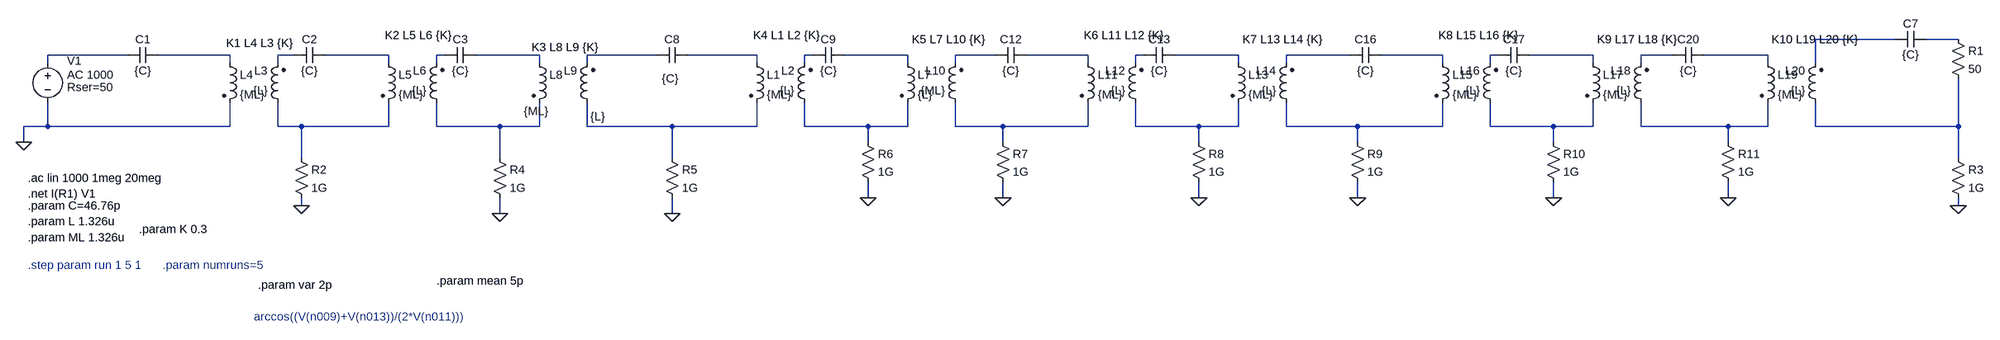
[diagram p0: schematic MI_ka.asc]
MI_ka.asc, the LTspice schematic file:
Version 4
SHEET 1 1260 680
WIRE 1072 96 912 96
WIRE 1200 96 1136 96
WIRE -2544 128 -2704 128
WIRE -2336 128 -2480 128
WIRE -2208 128 -2240 128
WIRE -2016 128 -2144 128
WIRE -1904 128 -1920 128
WIRE -1712 128 -1840 128
WIRE -1440 128 -1616 128
WIRE -1232 128 -1376 128
WIRE -1120 128 -1136 128
WIRE -928 128 -1056 128
WIRE -752 128 -832 128
WIRE -560 128 -688 128
WIRE -448 128 -464 128
WIRE -256 128 -384 128
WIRE -32 128 -160 128
WIRE 160 128 32 128
WIRE 272 128 256 128
WIRE 464 128 336 128
WIRE 624 128 560 128
WIRE 816 128 688 128
WIRE -2704 144 -2704 128
WIRE -2336 144 -2336 128
WIRE -2240 144 -2240 128
WIRE -2016 144 -2016 128
WIRE -1920 144 -1920 128
WIRE -1712 144 -1712 128
WIRE -1616 144 -1616 128
WIRE -1232 144 -1232 128
WIRE -1136 144 -1136 128
WIRE -928 144 -928 128
WIRE -832 144 -832 128
WIRE -560 144 -560 128
WIRE -464 144 -464 128
WIRE -256 144 -256 128
WIRE -160 144 -160 128
WIRE 160 144 160 128
WIRE 256 144 256 128
WIRE 464 144 464 128
WIRE 560 144 560 128
WIRE 816 144 816 128
WIRE 912 144 912 96
WIRE -2704 272 -2704 224
WIRE -2704 272 -2752 272
WIRE -2336 272 -2336 224
WIRE -2336 272 -2704 272
WIRE -2240 272 -2240 224
WIRE -2192 272 -2240 272
WIRE -2016 272 -2016 224
WIRE -2016 272 -2192 272
WIRE -1920 272 -1920 224
WIRE -1792 272 -1920 272
WIRE -1712 272 -1712 224
WIRE -1712 272 -1792 272
WIRE -1616 272 -1616 224
WIRE -1408 272 -1616 272
WIRE -1232 272 -1232 224
WIRE -1232 272 -1408 272
WIRE -1136 272 -1136 224
WIRE -1008 272 -1136 272
WIRE -928 272 -928 224
WIRE -928 272 -1008 272
WIRE -832 272 -832 224
WIRE -736 272 -832 272
WIRE -560 272 -560 224
WIRE -560 272 -736 272
WIRE -464 272 -464 224
WIRE -336 272 -464 272
WIRE -256 272 -256 224
WIRE -256 272 -336 272
WIRE -160 272 -160 224
WIRE -16 272 -160 272
WIRE 160 272 160 224
WIRE 160 272 -16 272
WIRE 256 272 256 224
WIRE 384 272 256 272
WIRE 464 272 464 224
WIRE 464 272 384 272
WIRE 560 272 560 224
WIRE 736 272 560 272
WIRE 816 272 816 224
WIRE 816 272 736 272
WIRE 912 272 912 224
WIRE 1200 272 1200 176
WIRE 1200 272 912 272
WIRE -2752 304 -2752 272
WIRE -1008 304 -1008 272
WIRE -736 304 -736 272
WIRE -336 304 -336 272
WIRE -16 304 -16 272
WIRE 384 304 384 272
WIRE 736 304 736 272
WIRE -2192 336 -2192 272
WIRE -1792 336 -1792 272
WIRE -1408 336 -1408 272
WIRE 1200 336 1200 272
WIRE -1008 416 -1008 384
WIRE -736 416 -736 384
WIRE -336 416 -336 384
WIRE -16 416 -16 384
WIRE 384 416 384 384
WIRE 736 416 736 384
WIRE -2192 432 -2192 416
WIRE 1200 432 1200 416
WIRE -1792 448 -1792 416
WIRE -1408 448 -1408 416
FLAG -2752 304 0
FLAG 1200 432 0
FLAG -1008 416 0
FLAG -736 416 0
FLAG -336 416 0
FLAG -16 416 0
FLAG 384 416 0
FLAG 736 416 0
FLAG -2192 432 0
FLAG -1792 448 0
FLAG -1408 448 0
SYMBOL voltage -2704 128 R0
WINDOW 0 39 12 Left 2
WINDOW 123 39 40 Left 2
WINDOW 39 39 65 Left 2
SYMATTR InstName V1
SYMATTR Value2 AC 1000
SYMATTR SpiceLine Rser=50
SYMATTR Value ""
SYMBOL res 1184 80 R0
SYMATTR InstName R1
SYMATTR Value 50
SYMBOL ind2 -2224 240 R180
WINDOW 0 36 80 Left 2
WINDOW 3 36 40 Left 2
SYMATTR InstName L3
SYMATTR Value {L}
SYMATTR Type ind
SYMBOL res 1184 320 R0
SYMATTR InstName R3
SYMATTR Value 1G
SYMBOL ind2 -2352 128 R0
SYMATTR InstName L4
SYMATTR Value {ML}
SYMATTR Type ind
SYMBOL cap -2480 112 R90
WINDOW 0 0 32 VBottom 2
WINDOW 3 32 32 VTop 2
SYMATTR InstName C1
SYMATTR Value {C}
SYMBOL cap -2144 112 R90
WINDOW 0 0 32 VBottom 2
WINDOW 3 32 32 VTop 2
SYMATTR InstName C2
SYMATTR Value {C}
SYMBOL ind2 -2032 128 R0
SYMATTR InstName L5
SYMATTR Value {ML}
SYMATTR Type ind
SYMBOL ind2 -1904 240 R180
WINDOW 0 36 80 Left 2
WINDOW 3 36 40 Left 2
SYMATTR InstName L6
SYMATTR Value {L}
SYMATTR Type ind
SYMBOL cap -1840 112 R90
WINDOW 0 0 32 VBottom 2
WINDOW 3 32 32 VTop 2
SYMATTR InstName C3
SYMATTR Value {C}
SYMBOL ind2 -1728 128 R0
WINDOW 3 -16 113 Left 2
SYMATTR Value {ML}
SYMATTR InstName L8
SYMATTR Type ind
SYMBOL ind2 -1600 240 R180
WINDOW 0 36 80 Left 2
WINDOW 3 -20 -12 Left 2
SYMATTR InstName L9
SYMATTR Value {L}
SYMATTR Type ind
SYMBOL cap 1136 80 R90
WINDOW 0 0 32 VBottom 2
WINDOW 3 32 32 VTop 2
SYMATTR InstName C7
SYMATTR Value {C}
SYMBOL cap -1376 112 R90
WINDOW 0 0 32 VBottom 2
WINDOW 3 48 36 VTop 2
SYMATTR InstName C8
SYMATTR Value {C}
SYMBOL ind2 -1248 128 R0
SYMATTR InstName L1
SYMATTR Value {ML}
SYMATTR Type ind
SYMBOL ind2 -1120 240 R180
WINDOW 0 36 80 Left 2
WINDOW 3 36 40 Left 2
SYMATTR InstName L2
SYMATTR Value {L}
SYMATTR Type ind
SYMBOL cap -1056 112 R90
WINDOW 0 0 32 VBottom 2
WINDOW 3 32 32 VTop 2
SYMATTR InstName C9
SYMATTR Value {C}
SYMBOL ind2 -944 128 R0
SYMATTR InstName L7
SYMATTR Value {L}
SYMATTR Type ind
SYMBOL ind2 -816 240 R180
WINDOW 0 36 80 Left 2
WINDOW 3 36 40 Left 2
SYMATTR InstName L10
SYMATTR Value {ML}
SYMATTR Type ind
SYMBOL res -1024 288 R0
SYMATTR InstName R6
SYMATTR Value 1G
SYMBOL cap -688 112 R90
WINDOW 0 0 32 VBottom 2
WINDOW 3 32 32 VTop 2
SYMATTR InstName C12
SYMATTR Value {C}
SYMBOL ind2 -576 128 R0
SYMATTR InstName L11
SYMATTR Value {ML}
SYMATTR Type ind
SYMBOL ind2 -448 240 R180
WINDOW 0 36 80 Left 2
WINDOW 3 36 40 Left 2
SYMATTR InstName L12
SYMATTR Value {L}
SYMATTR Type ind
SYMBOL res -752 288 R0
SYMATTR InstName R7
SYMATTR Value 1G
SYMBOL cap -384 112 R90
WINDOW 0 0 32 VBottom 2
WINDOW 3 32 32 VTop 2
SYMATTR InstName C13
SYMATTR Value {C}
SYMBOL ind2 -272 128 R0
SYMATTR InstName L13
SYMATTR Value {ML}
SYMATTR Type ind
SYMBOL ind2 -144 240 R180
WINDOW 0 36 80 Left 2
WINDOW 3 36 40 Left 2
SYMATTR InstName L14
SYMATTR Value {L}
SYMATTR Type ind
SYMBOL res -352 288 R0
SYMATTR InstName R8
SYMATTR Value 1G
SYMBOL cap 32 112 R90
WINDOW 0 0 32 VBottom 2
WINDOW 3 32 32 VTop 2
SYMATTR InstName C16
SYMATTR Value {C}
SYMBOL ind2 144 128 R0
SYMATTR InstName L15
SYMATTR Value {ML}
SYMATTR Type ind
SYMBOL ind2 272 240 R180
WINDOW 0 36 80 Left 2
WINDOW 3 36 40 Left 2
SYMATTR InstName L16
SYMATTR Value {L}
SYMATTR Type ind
SYMBOL res -32 288 R0
SYMATTR InstName R9
SYMATTR Value 1G
SYMBOL cap 336 112 R90
WINDOW 0 0 32 VBottom 2
WINDOW 3 32 32 VTop 2
SYMATTR InstName C17
SYMATTR Value {C}
SYMBOL ind2 448 128 R0
SYMATTR InstName L17
SYMATTR Value {ML}
SYMATTR Type ind
SYMBOL ind2 576 240 R180
WINDOW 0 36 80 Left 2
WINDOW 3 36 40 Left 2
SYMATTR InstName L18
SYMATTR Value {L}
SYMATTR Type ind
SYMBOL res 368 288 R0
SYMATTR InstName R10
SYMATTR Value 1G
SYMBOL cap 688 112 R90
WINDOW 0 0 32 VBottom 2
WINDOW 3 32 32 VTop 2
SYMATTR InstName C20
SYMATTR Value {C}
SYMBOL ind2 800 128 R0
SYMATTR InstName L19
SYMATTR Value {ML}
SYMATTR Type ind
SYMBOL ind2 928 240 R180
WINDOW 0 36 80 Left 2
WINDOW 3 36 40 Left 2
SYMATTR InstName L20
SYMATTR Value {L}
SYMATTR Type ind
SYMBOL res 720 288 R0
SYMATTR InstName R11
SYMATTR Value 1G
SYMBOL res -2208 320 R0
SYMATTR InstName R2
SYMATTR Value 1G
SYMBOL res -1808 320 R0
SYMATTR InstName R4
SYMATTR Value 1G
SYMBOL res -1424 320 R0
SYMATTR InstName R5
SYMATTR Value 1G
TEXT -2744 376 Left 2 !.ac lin 1000 1meg 20meg
TEXT -2744 408 Left 2 !.net I(R1) V1
TEXT -2344 104 Left 2 !K1 L4 L3 {K}
TEXT -2744 432 Left 2 !.param C=46.76p
TEXT -2744 464 Left 2 !.param L 1.326u
TEXT -2024 88 Left 2 !K2 L5 L6 {K}
TEXT -1728 112 Left 2 !K3 L8 L9 {K}
TEXT -2280 592 Left 2 !.param var 2p
TEXT -2520 480 Left 2 !.param K 0.3
TEXT -1240 88 Left 2 !K4 L1 L2 {K}
TEXT -920 96 Left 2 !K5 L7 L10 {K}
TEXT -568 88 Left 2 !K6 L11 L12 {K}
TEXT -248 96 Left 2 !K7 L13 L14 {K}
TEXT 152 88 Left 2 !K8 L15 L16 {K}
TEXT 472 96 Left 2 !K9 L17 L18 {K}
TEXT 824 96 Left 2 !K10 L19 L20 {K}
TEXT -2744 552 Left 2 ;.step param run 1 5 1
TEXT -2472 552 Left 2 ;.param numruns=5
TEXT -1920 584 Left 2 !.param mean 5p
TEXT -2744 496 Left 2 !.param ML 1.326u
TEXT -2288 656 Left 2 ;arccos((V(n009)+V(n013))/(2*V(n011)))

The netlist it stands for:
* MI_ka.asc
V1 N003 0 AC 1000 Rser=50
R1 N002 N032 50
L3 N023 N005 {L}
R3 N032 0 1G
L4 N004 0 {ML}
C1 N004 N003 {C}
C2 N006 N005 {C}
L5 N006 N023 {ML}
L6 N024 N007 {L}
C3 N008 N007 {C}
L8 N008 N024 {ML}
L9 N025 N009 {L}
C7 N002 N001 {C}
C8 N010 N009 {C}
L1 N010 N025 {ML}
L2 N026 N011 {L}
C9 N012 N011 {C}
L7 N012 N026 {L}
L10 N027 N013 {ML}
R6 N026 0 1G
C12 N014 N013 {C}
L11 N014 N027 {ML}
L12 N028 N015 {L}
R7 N027 0 1G
C13 N016 N015 {C}
L13 N016 N028 {ML}
L14 N029 N017 {L}
R8 N028 0 1G
C16 N018 N017 {C}
L15 N018 N029 {ML}
L16 N030 N019 {L}
R9 N029 0 1G
C17 N020 N019 {C}
L17 N020 N030 {ML}
L18 N031 N021 {L}
R10 N030 0 1G
C20 N022 N021 {C}
L19 N022 N031 {ML}
L20 N032 N001 {L}
R11 N031 0 1G
R2 N023 0 1G
R4 N024 0 1G
R5 N025 0 1G
.ac lin 1000 1meg 20meg
.net I(R1) V1
K1 L4 L3 {K}
.param C=46.76p
.param L 1.326u
K2 L5 L6 {K}
K3 L8 L9 {K}
.param var 2p
.param K 0.3
K4 L1 L2 {K}
K5 L7 L10 {K}
K6 L11 L12 {K}
K7 L13 L14 {K}
K8 L15 L16 {K}
K9 L17 L18 {K}
K10 L19 L20 {K}
* .step param run 1 5 1
* .param numruns=5
.param mean 5p
.param ML 1.326u
* arccos((V(n009)+V(n013))/(2*V(n011)))
.backanno
.end